# Altium schematic sheet Main.SchDoc
size A; SheetNumber: 1; SheetTotal: 6
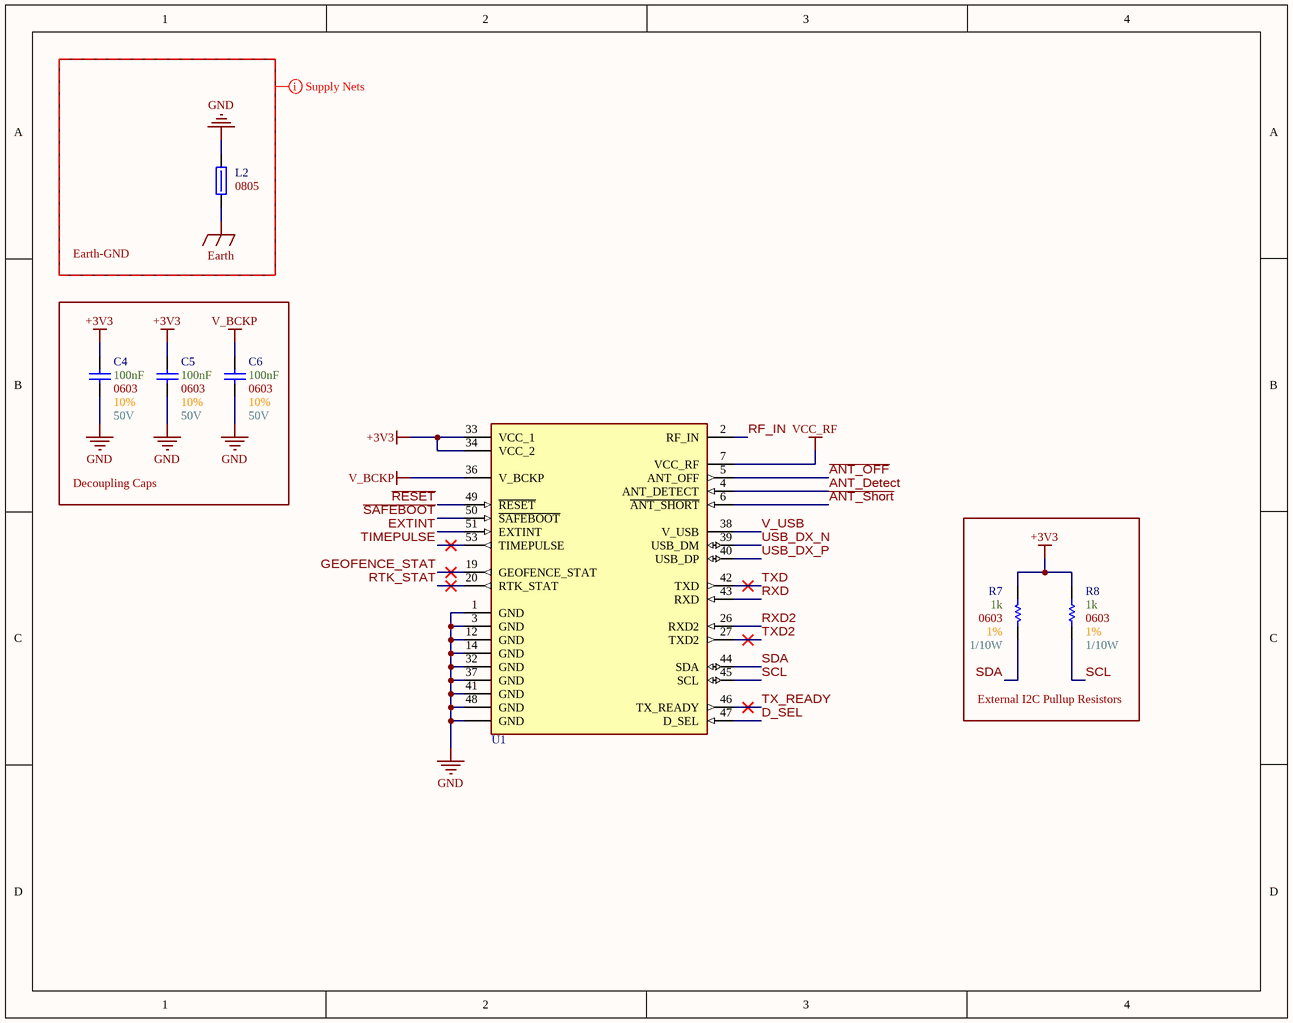
[diagram p0: Main.SchDoc]

## Parts
C4  Max Voltage: 50V  Size Package: 0603  Tolerance: 10%  Capacitance: 100nF  [[Cap] SMD 0603]  (hidden comment: [Cap] 0603 0.1uF 10% 50V)
C5  Max Voltage: 50V  Size Package: 0603  Tolerance: 10%  Capacitance: 100nF  [[Cap] SMD 0603]  (hidden comment: [Cap] 0603 0.1uF 10% 50V)
C6  Max Voltage: 50V  Size Package: 0603  Tolerance: 10%  Capacitance: 100nF  [[Cap] SMD 0603]  (hidden comment: [Cap] 0603 0.1uF 10% 50V)
L2  Size Package: 0805  [[Ferrite] SMD 0805]  (hidden comment: 652-MH2029-300Y)
R7  Wattage: 1/10W  Tolerance: 1%  Resistance: 1k  Size Package: 0603  [[Res] SMD 0603]  (hidden comment: [1k] SMD 0603 1% 1/10W)
R8  Wattage: 1/10W  Tolerance: 1%  Resistance: 1k  Size Package: 0603  [[Res] SMD 0603]  (hidden comment: [1k] SMD 0603 1% 1/10W)
U1  High-Precision Triple Band GNSS Module  [[GNSS] ZED-F20P-00B]  (value not drawn)

## Blocks framed on the sheet
Earth-GND: L2
Decoupling Caps: C4-C6
External I2C Pullup Resistors: R7 R8

## Nets
+3V3: C4.2 C5.2 R7.2 R8.2 U1.33(VCC_1) U1.34(VCC_2)
Earth: L2.1
GND: C4.1 C5.1 C6.1 L2.2 U1.1(GND) U1.3(GND) U1.12(GND) U1.14(GND) U1.32(GND) U1.37(GND) U1.41(GND) U1.48(GND) U1.GND
V_BCKP: C6.2 U1.36(V_BCKP)
VCC_RF: U1.7(VCC_RF)
~{ANT_OFF}: U1.5(ANT_OFF)
~{ANT_Short}: U1.6(~{ANT_SHORT})
~{RESET}: U1.49(~{RESET})
~{SAFEBOOT}: U1.50(~{SAFEBOOT})
ANT_Detect: U1.4(ANT_DETECT)
D_SEL: U1.47(D_SEL)
EXTINT: U1.51(EXTINT)
GEOFENCE_STAT: U1.19(GEOFENCE_STAT)
RF_IN: U1.2(RF_IN)
RTK_STAT: U1.20(RTK_STAT)
RXD: U1.43(RXD)
RXD2: U1.26(RXD2)
SCL: R8.1 U1.45(SCL)
SDA: R7.1 U1.44(SDA)
TIMEPULSE: U1.53(TIMEPULSE)
TX_READY: U1.46(TX_READY)
TXD: U1.42(TXD)
TXD2: U1.27(TXD2)
USB_DX_N: U1.39(USB_DM)
USB_DX_P: U1.40(USB_DP)
V_USB: U1.38(V_USB)

## Layout directives
net class Supply_Nets: Earth, GND

## Library data of the parts
C4-C6 = [Cap] 0603 0.1uF 10% 50V: CL10B104KB8NNNC; Supplier 1: DigiKey; Supplier Part Number 1: 1276-1000-6-ND
L2 = [Ferrite] SMD 0805 3A 30ohm: Res @ Freq: 30 @ 100MHz; Supplier 1: DigiKey; Supplier Part Number 1: MH2029-300YCT-ND
R7 R8 = [1k] SMD 0603 1% 1/10W: RMCF0603FT1K00; Supplier 1: DigiKey; Supplier Part Number 1: RMCF0603FT1K00DKR-ND
U1 = [GNSS] ZED-F20P-00B: ZED-F20P-00B; Supplier 1: DigiKey; Supplier Part Number 1: 672-ZED-F20P-00BDKR-ND